# EAGLE schematic Equilizer Protoboard (EAGLE 6.3)
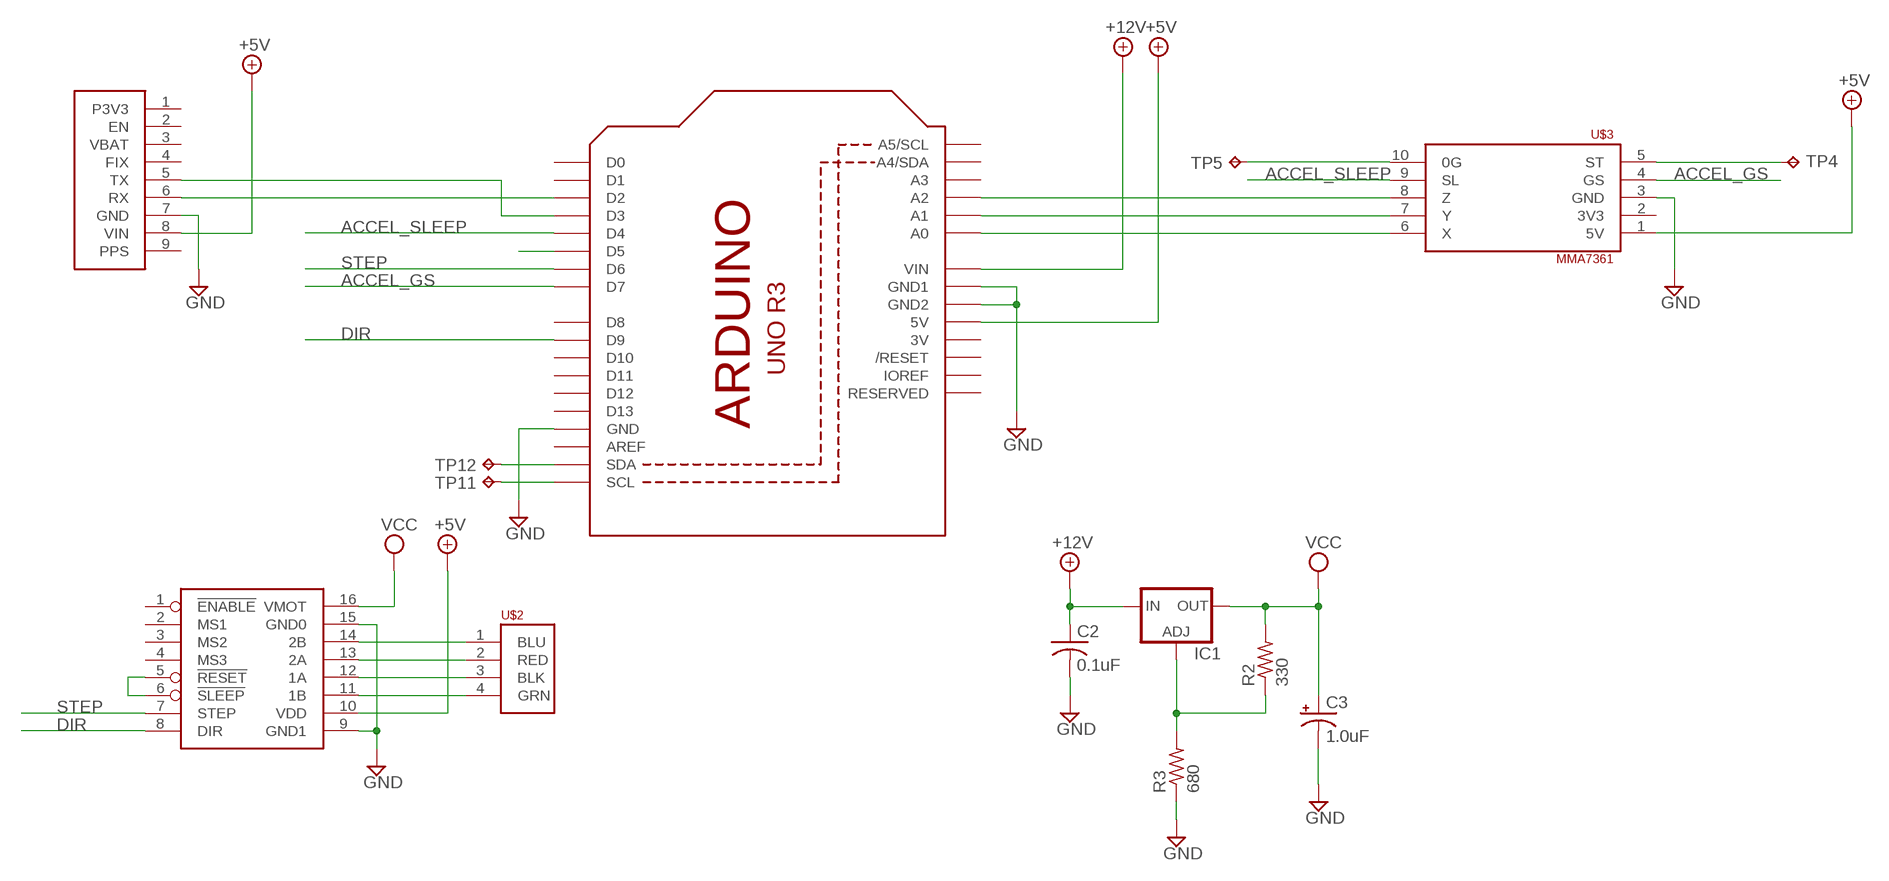
[diagram p0: schematic, sheet 1]

## Parts
C2  0.1uF  C-US050-025X075  [C050-025X075]
C3  1.0uF  CPOL-USE3.5-8  [E3,5-8]
IC1  LM317TL  [317TL]
R2  330  R-US_0207/7  [0207/7]
R3  680  R-US_0207/7  [0207/7]
TP4  TPPAD1-13  [P1-13]
TP5  TPPAD1-13  [P1-13]
TP11  TPPAD1-13  [P1-13]
TP12  TPPAD1-13  [P1-13]
U1  ARDUINOR3-BPLACE  [ARDUINOR3-BPLACE]
U$1  A4988  [A4988]
U$2  POLOLU_STEPPER  [POLOLU_STEPPER]
U$3  MMA7361  [MMA7361]
U$4  ADAFRUIT_GPS_MODULE  [ADAFRUIT_GPS_BREAKOUT]

## Nets
+5V [power]: U1.5V U$1.10(VDD) U$3.1(5V) U$4.8(VIN)
+12V [power]: C2.1 IC1.3(IN) U1.VIN
ACCEL_GS: U1.D7 U$3.4(GS)
ACCEL_SLEEP: U1.D4 U$3.9(SL)
DIR: U1.D9 U$1.8(DIR)
GND [power]: C2.2 C3.- U1.GND U1.GND1 U1.GND2 U$1.9(GND1) U$1.15(GND0) U$3.3(GND) U$4.7(GND)
N$1: U$1.5(!RESET) U$1.6(!SLEEP)
N$2: U1.D2 U$4.6(RX)
N$3: U$1.14(2B) U$2.1(BLU)
N$4: U1.D3 U$4.5(TX)
N$5: U$1.13(2A) U$2.2(RED)
N$6: U$1.12(1A) U$2.3(BLK)
N$7: U$1.11(1B) U$2.4(GRN)
N$10: U1.A2 U$3.8(Z)
N$11: U1.A1 U$3.7(Y)
N$12: U1.A0 U$3.6(X)
N$13: TP5.TP U$3.10(0G)
N$17: TP11.TP U1.SCL
N$18: TP12.TP U1.SDA
N$21: TP4.TP U$3.5(ST)
N$22: IC1.1(ADJ) R2.1 R3.2
N$29: U1.D5
STEP: U1.D6 U$1.7(STEP)
VCC [power]: C3.+ IC1.2(OUT) R2.2 U$1.16(VMOT)
Unconnected: R3.1 U1.A3 U1.A4(A4/SDA) U1.A5(A5/SCL) U1.AREF U1.D0 U1.D1 U1.D8 U1.D10 U1.D11 U1.D12 U1.D13 U1.IOREF U1.RESERVED U1.RESET(/RESET) U$1.1(!ENABLE) U$1.2(MS1) U$1.3(MS2) U$1.4(MS3) U$3.2(3V3) U$4.1(P3V3) U$4.2(EN) U$4.3(VBAT) U$4.4(FIX) U$4.9(PPS)

## Power pins joined to a net without a drawn wire
3V: U1.3V

## Library data of the parts
C2 = adafruit:C-US: CAPACITOR, American symbol
C3 = adafruit:CPOL-US: POLARIZED CAPACITOR, American symbol
IC1 = v-reg:LM317TL: VOLTAGE REGULATOR
R2 R3 = adafruit:R-US_: RESISTOR, American symbol
TP4 TP5 TP11 TP12 = testpad:TP: Test pad
U1 = custom:ARDUINOR3: This is a new object for the new Arduino R3 - with extra pins that you may want to use (such as IOref, and duplicated A4/A5
U$1 = custom:A4988
U$2 = custom:POLOLU_STEPPER
U$3 = custom:MMA7361
U$4 = custom:ADAFRUIT_GPS_MODULE

## Net classes
0 default: width 0.508 mm, drill 0.889 mm, clearance 0.508 mm
1 power: width 1.27 mm, drill 0.889 mm, clearance 0.508 mm to class 0, clearance 0.508 mm